# EAGLE design ATMegaBoardReduced (EAGLE 9.5.0)
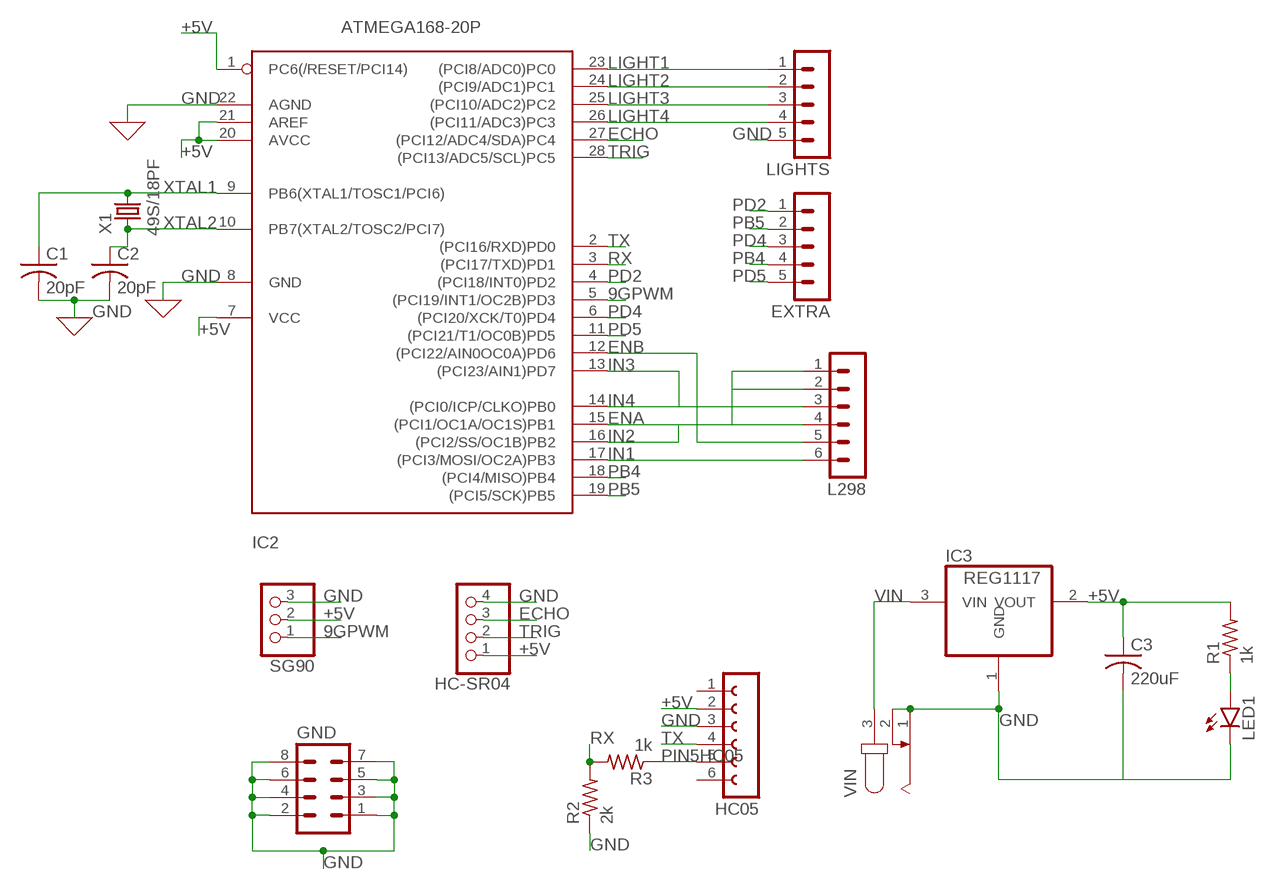
[diagram p0: schematic, sheet 1]

## Parts
C1  20pF  C-US050-024X044  [C050-024X044]
C2  20pF  C-US050-024X044  [C050-024X044]
C3  220uF  C-US050-024X044  [C050-024X044]
EXTRA  MA05-1  [MA05-1]
GND  MA04-2  [MA04-2]
HC05  FE06W  [FE06W]
HC-SR04  PINHD-1X4  [1X04]
IC2  ATMEGA168-20P  [DIL28-3]
IC3  REG1117  [SOT223]
L298  MA06-1  [MA06-1]
LED1  LED5MM  [LED5MM]
LIGHTS  MA05-1  [MA05-1]
R1  1k  R-US_0207/10  [0207/10]
R2  2k  R-US_0207/10  [0207/10]
R3  1k  R-US_0207/10  [0207/10]
SG90  PINHD-1X3  [1X03]
VIN  JACK-PLUG1  [SPC4078]
X1  49S/18PF  [XTAL_HC49]

## Nets
9GPWM: IC2.5((PCI19/INT1/OC2B)PD3) SG90.1
+5V [5v]: C3.1 HC05.2 HC-SR04.1 IC2.1(PC6(/RESET/PCI14)) IC2.7(VCC) IC2.20(AVCC) IC2.21(AREF) IC3.2(VOUT) R1.2 SG90.2
ECHO: HC-SR04.3 IC2.27((PCI12/ADC4/SDA)PC4)
ENA: IC2.15((PCI1/OC1A/OC1S)PB1) L298.2
ENB: IC2.12((PCI22/AIN0OC0A)PD6) L298.5
GND [Power]: C1.2 C2.2 C3.2 GND.1 GND.2 GND.3 GND.4 GND.5 GND.6 GND.7 GND.8 HC05.3 HC-SR04.4 IC2.8(GND) IC2.22(AGND) IC3.1(GND) LED1.K(C) LIGHTS.5 R2.1 SG90.3 VIN.1 VIN.2
IN1: IC2.17((PCI3/MOSI/OC2A)PB3) L298.6
IN2: IC2.16((PCI2/SS/OC1B)PB2) L298.4
IN3: IC2.13((PCI23/AIN1)PD7) L298.3
IN4: IC2.14((PCI0/ICP/CLKO)PB0) L298.1
LIGHT1: IC2.23((PCI8/ADC0)PC0) LIGHTS.1
LIGHT2: IC2.24((PCI9/ADC1)PC1) LIGHTS.2
LIGHT3: IC2.25((PCI10/ADC2)PC2) LIGHTS.3
LIGHT4: IC2.26((PCI11/ADC3)PC3) LIGHTS.4
N$3: LED1.A R1.1
PB4: EXTRA.4 IC2.18((PCI4/MISO)PB4)
PB5: EXTRA.2 IC2.19((PCI5/SCK)PB5)
PD2: EXTRA.1 IC2.4((PCI18/INT0)PD2)
PD4: EXTRA.3 IC2.6((PCI20/XCK/T0)PD4)
PD5: EXTRA.5 IC2.11((PCI21/T1/OC0B)PD5)
PIN5HC05: HC05.5 R3.1
RX: IC2.3((PCI17/TXD)PD1) R2.2 R3.2
TRIG: HC-SR04.2 IC2.28((PCI13/ADC5/SCL)PC5)
TX: HC05.4 IC2.2((PCI16/RXD)PD0)
VIN [Power]: IC3.3(VIN) VIN.3
XTAL1: C1.1 IC2.9(PB6(XTAL1/TOSC1/PCI6)) X1.2
XTAL2: C2.1 IC2.10(PB7(XTAL2/TOSC2/PCI7)) X1.1
Unconnected: HC05.1 HC05.6

## Library data of the parts
C1-C3 = rcl:C-US: CAPACITOR, American symbol; SPICEPREFIX: C
EXTRA LIGHTS = con-lstb:MA05-1: PIN HEADER; OC_FARNELL: unknown; OC_NEWARK: unknown
GND = con-lstb:MA04-2: PIN HEADER; OC_FARNELL: unknown; OC_NEWARK: unknown
HC05 = con-lsta:FE06W: FEMALE HEADER; OC_FARNELL: unknown; OC_NEWARK: unknown
HC-SR04 = pinhead:PINHD-1X4: PIN HEADER
IC2 = adafruit:ATMEGA168*P: MICROCONTROLLER 16 kBytes FLASH 1 kBytes SRAM 512 Bytes EEPROM USART 8-channel 10 bit ADC
IC3 = burr-brown:REG1117: 800mA and 1A Low Dropout (LDO) Positive Regulator 1.8V, 2.5V, 2.85V, 3.3V, 5V, and Adj; MPN: REG1117; OC_FARNELL: 1097566; OC_NEWARK: 14P6981
L298 = con-lstb:MA06-1: PIN HEADER; OC_FARNELL: unknown; OC_NEWARK: unknown
LED1 = led:LED: LED OSRAM: - CHIPLED LG R971, LG N971, LY N971, LG Q971, LY Q971, LO R971, LY R971 LH N974, LH R974 LS Q976, LO Q976, LY Q976 LO Q996 - Hyper CHIPLED LW Q18S LB Q993, LB Q99A, LB R99A - SideLED LS A670, LO A670, LY A670, LG A670, LP A670 LB A673, LV A673, LT A673, LW A673 LH A674 LY A675 LS A676, LA A676, LO A676, LY A676, LW A676 LS A679, LY A679, LG A679 - Hyper Micro SIDELED® LS Y876, LA Y876, LO Y876, LY Y876 LT Y87S - SmartLED LW L88C, LW L88S LB L89C, LB L89S, LG L890 LS L89K, LO L89K, LY L89K LS L896, LA L896, LO L896, LY L896 - TOPLED LS T670, LO T670, LY T670, LG T670, LP T670 LSG T670, LSP T670, LSY T670, LOP T670, LYG T670 LG T671, LOG T671, LSG T671 LB T673, LV T673, LT T673, LW T673 LH T674 LS T676, LA T676, LO T676, LY T676, LB T676, LH T676, LSB T676, LW T676 LB T67C, LV T67C, LT T67C, LS T67K, LO T67K, LY T67K, LW E67C LS E67B, LA E67B, LO E67B, LY E67B, LB E67C, LV E67C, LT E67C LW T67C LS T679, LY T679, LG T679 LS T770, LO T770, LY T770, LG T770, LP T770 LB T773, LV T773, LT T773, LW T773 LH T774 LS E675, LA E675, LY E675, LS T675 LS T776, LA T776, LO T776, LY T776, LB T776 LHGB T686 LT T68C, LB T68C - Hyper Mini TOPLED® LB M676 - Mini TOPLED Santana® LG M470 LS M47K, LO M47K, LY M47K Source: http://www.osram.convergy.de LUXEON: - LUMILED® LXK2-PW12-R00, LXK2-PW12-S00, LXK2-PW14-U00, LXK2-PW14-V00 LXK2-PM12-R00, LXK2-PM12-S00, LXK2-PM14-U00 LXK2-PE12-Q00, LXK2-PE12-R00, LXK2-PE12-S00, LXK2-PE14-T00, LXK2-PE14-U00 LXK2-PB12-K00, LXK2-PB12-L00, LXK2-PB12-M00, LXK2-PB14-N00, LXK2-PB14-P00, LXK2-PB14-Q00 LXK2-PR12-L00, LXK2-PR12-M00, LXK2-PR14-Q00, LXK2-PR14-R00 LXK2-PD12-Q00, LXK2-PD12-R00, LXK2-PD12-S00 LXK2-PH12-R00, LXK2-PH12-S00 LXK2-PL12-P00, LXK2-PL12-Q00, LXK2-PL12-R00 Source: www.luxeon.com KINGBRIGHT: KA-3528ASYC Source: www.kingbright.com
R1-R3 = rcl:R-US_: RESISTOR, American symbol; SPICEPREFIX: R
SG90 = pinhead:PINHD-1X3: PIN HEADER
VIN = con-jack:JACK-PLUG: DC POWER JACK Power Jack, DC, Right Angle, Through Hole, Rated 5A at 16VDC, PC Terminals Distributor: Farnell (www.Farnell.de) Drawing: 84N1161.pdf / 84N1162.pdf Manufacturer: SPC Technology (www.spctechnology.com) Type: SPC4077 / SPC 4078; OC_FARNELL: unknown; OC_NEWARK: unknown
X1 = Crystals:49S/18PF: Crystal Manufacturer's datasheet <https://datasheet.octopart.com/49S-18PF-Xinhunjing-datasheet-30677139.pdf>; CREATED_BY: PCBLayout.com; MANUFACTURER: Xinhunjing; MPN: 49S/18PF; PACKAGE: SMD

## Net classes
1 Power: width 1.778 mm
2 5v: width 0.762 mm

## Board
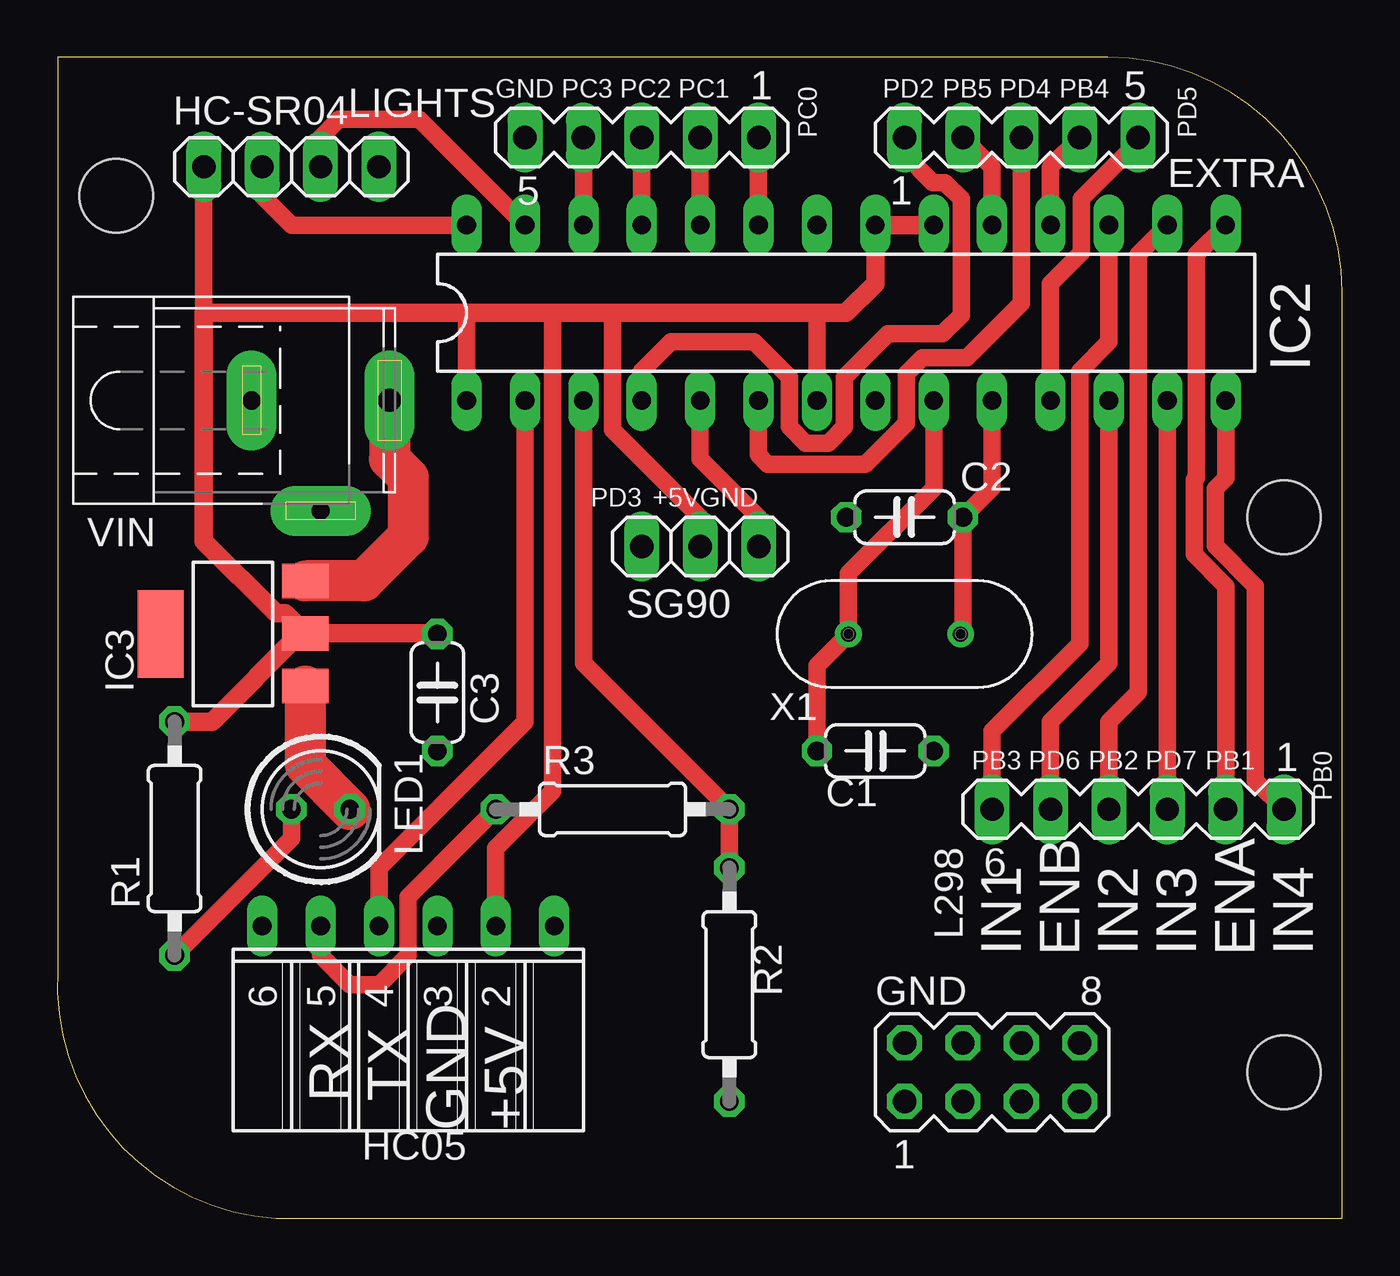
[diagram p1: board, top side]
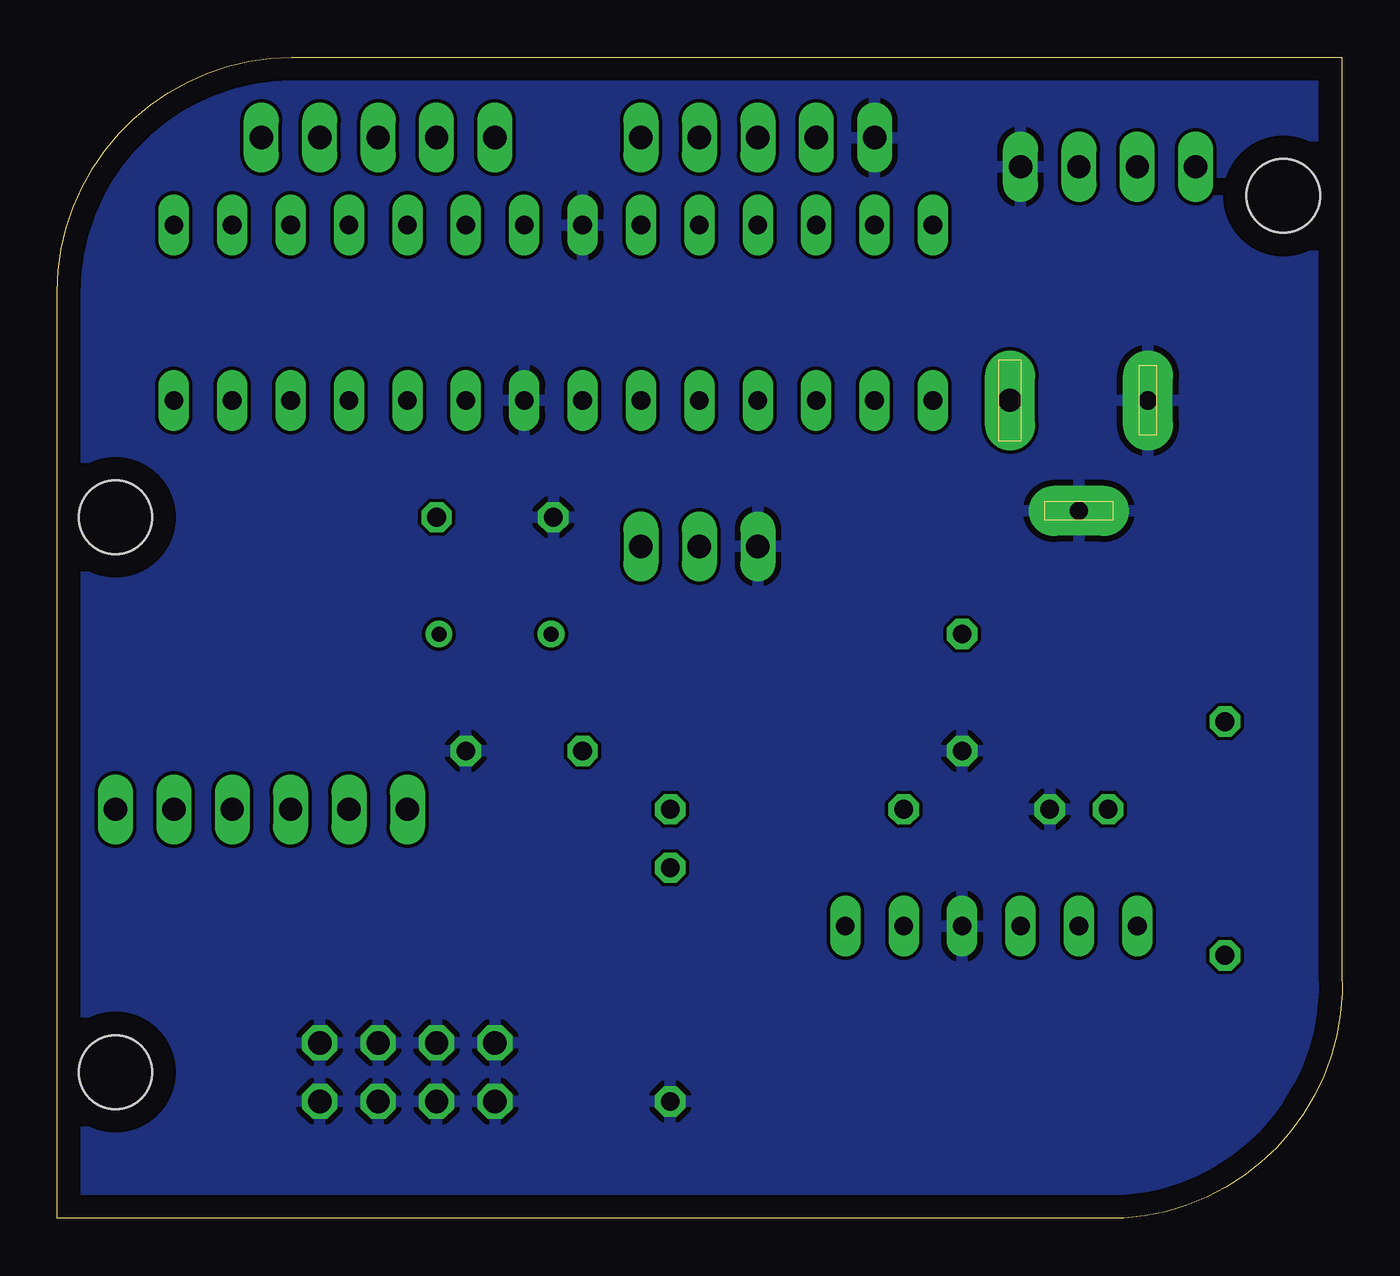
[diagram p2: board, bottom side, seen from below]

Size 55.88 x 50.47 mm. Coordinates in mm from the lower left corner, seen from the top.
Outline: 45.69,50.47 0.02,50.47 0.02,10.75 arc90 9.49,0 55.88,0 55.88,40.28 arc90 45.69,50.47
Copper layers (1*16): Top 0.035mm / dielectric 1.5mm / Bottom 0.035mm
Design rules "default *": minimum track width 30mil, minimum drill 0.35mm, track to track 6mil, track to pad 6mil, pad to pad 6mil, via to via 6mil, smd to smd 6mil, copper to edge 40mil, drill to drill 6mil, minimum pad ring 10mil, minimum via ring 8mil, stop-mask expansion 4mil, vias tented up to drill 0mil, thermal gap 10mil
Holes 3.2 mm at 2.56,44.45 53.36,30.48 53.36,6.35

### Footprints (pad centres in the part's own frame; a part is rotated, then mirrored left to right if it is on the bottom)
C050-024X044 = drill 0.813 octagon: 1 -2.54,0; 2 2.54,0
MA05-1 = drill 1.016 long: 1 -5.08,0; 2 -2.54,0; 3 0,0; 4 2.54,0; 5 5.08,0
MA04-2 = drill 1.016 octagon: 1 -3.81,-1.27; 2 -3.81,1.27; 3 -1.27,-1.27; 4 -1.27,1.27; 5 1.27,-1.27; 6 1.27,1.27; 7 3.81,-1.27; 8 3.81,1.27
FE06W = drill 0.813 long: 1 -6.35,0; 2 -3.81,0; 3 -1.27,0; 4 1.27,0; 5 3.81,0; 6 6.35,0
1X04 = drill 1.016 long: 1 -3.81,0; 2 -1.27,0; 3 1.27,0; 4 3.81,0
DIL28-3 = drill 0.813 long: 1 -16.51,-3.81; 2 -13.97,-3.81; 3 -11.43,-3.81; 4 -8.89,-3.81; 5 -6.35,-3.81; 6 -3.81,-3.81; 7 -1.27,-3.81; 8 1.27,-3.81; 9 3.81,-3.81; 10 6.35,-3.81; 11 8.89,-3.81; 12 11.43,-3.81; 13 13.97,-3.81; 14 16.51,-3.81; 15 16.51,3.81; 16 13.97,3.81; 17 11.43,3.81; 18 8.89,3.81; 19 6.35,3.81; 20 3.81,3.81; 21 1.27,3.81; 22 -1.27,3.81; 23 -3.81,3.81; 24 -6.35,3.81; 25 -8.89,3.81; 26 -11.43,3.81; 27 -13.97,3.81; 28 -16.51,3.81
SOT223 = smd 1.499 x 2.007: 1 -2.261,-3.15; 2 0.025,-3.15; 3 2.311,-3.15 | smd 3.81 x 2.007: 4 0,3.15
MA06-1 = drill 1.016 long: 1 -6.35,0; 2 -3.81,0; 3 -1.27,0; 4 1.27,0; 5 3.81,0; 6 6.35,0
LED5MM = drill 0.813 octagon: A -1.27,0; K 1.27,0
0207/10 = drill 0.813 octagon: 1 -5.08,0; 2 5.08,0
1X03 = drill 1.016 long: 1 -2.54,0; 2 0,0; 3 2.54,0
SPC4078 = drill 0.8 pad 2.184 long: 1 -3,0; 2 0,-4.8 | drill 1 pad 2.184 long: 3 3,0
XTAL_HC49 = drill 0.65 pad 1.05: 1 -2.44,0; 2 2.44,0

### Placement (x,y rotation side)
C1  35.58,20.32 0 top
C2  36.85,30.48 180 top
C3  16.53,22.86 270 top
EXTRA  41.93,46.99 0 top
GND  40.66,6.35 0 top
HC05  15.26,12.7 180 top
HC-SR04  10.18,45.72 0 top
IC2  34.31,39.37 0 top
IC3  7.64,25.4 90 top
L298  47.01,17.78 180 top
LED1  11.45,17.78 0 top
LIGHTS  25.42,46.99 180 top
R1  5.1,16.51 90 top
R2  29.23,10.16 90 top
R3  24.15,17.78 0 top
SG90  27.96,29.21 180 top
VIN  11.45,35.56 0 top
X1  36.85,25.4 180 top

### Tracks (layer width: path | path; a pad name or v marks a point on that pad's centre or on a via)
9GPWM
  Top 0.762: SG90.1 30.5,30.48 27.96,33.02 IC2.5
+5V
  Top 0.762: IC2.7 33.04,39.37 | 24.15,39.37 24.15,34.29 27.96,30.48 SG90.2 | HC-SR04.1 6.37,39.37 | HC05.2 19.07,16.09 21.53,18.56 21.53,39.29 | 16.5,25.42 C3.1 | 10.56,25.42 IC3.2 | 21.53,39.29 21.45,39.37 | 21.53,39.29 21.61,39.37 | IC2.1 17.8,39.37
  Top 0.813: 10.56,25.42 6.73,21.59 R1.2 | 21.45,39.37 17.8,39.37 6.37,39.37 6.37,29.44 9.51,26.3 9.91,26.3 IC3.2 16.5,25.42 | IC2.20 IC2.21 35.58,40.64 34.31,39.37 33.04,39.37 24.15,39.37 21.61,39.37
ECHO
  Top 0.762: HC-SR04.3 11.45,46.99 12.23,47.78 15.74,47.78 IC2.27
ENA
  Top 0.762: IC2.15 49.55,41.91 49.55,32.2 49.44,32.1 49.44,28.86 50.82,27.49 L298.2
ENB
  Top 0.762: L298.5 43.2,21.59 45.74,24.13 IC2.12
GND
  Top 1.778: LED1.K 10.79,19.71 IC3.1
  pour Bottom: 0.02,0 0.02,50.8 55.9,50.8 55.9,0
IN1
  Top 0.762: IC2.17 45.74,38.1 44.47,36.83 44.47,24.98 40.66,21.17 L298.6
IN2
  Top 0.762: L298.4 45.74,21.59 47.01,22.86 47.01,41.91 IC2.16
IN3
  Top 0.762: IC2.13 L298.3
IN4
  Top 0.762: L298.1 52.11,19.02 52.11,27.49 50.36,29.24 50.36,31.72 50.82,32.18 IC2.14
LIGHT1
  Top 0.762: LIGHTS.1 IC2.23
LIGHT2
  Top 0.762: LIGHTS.2 IC2.24
LIGHT3
  Top 0.762: LIGHTS.3 IC2.25
LIGHT4
  Top 0.762: LIGHTS.4 IC2.26
N$3
  Top 0.762: LED1.A 10.18,16.51 R1.1
PB4
  Top 0.762: IC2.18 43.2,45.67 43.22,45.69 43.22,45.75 EXTRA.4
PB5
  Top 0.762: IC2.19 40.66,45.72 EXTRA.2
PD2
  Top 0.762: EXTRA.1 36.85,46.28 38.09,45.03 38.61,45.03 39.31,44.34 39.31,39.27 38.49,38.46 36.12,38.46 34.23,36.56 34.23,34.41 33.53,33.71 32.54,33.71 31.84,34.41 31.84,36.56 30.3,38.1 26.69,38.1 25.42,36.83 IC2.4
PD4
  Top 0.762: IC2.6 30.5,33.19 30.89,32.79 35.16,32.79 36.92,34.56 36.92,36.72 37.62,37.41 39.56,37.41 41.93,39.78 41.93,45.67 41.95,45.69 41.95,46.97 EXTRA.3
PD5
  Top 0.762: IC2.11 43.2,40.64 44.54,41.99 44.54,44.34 47.01,46.8 EXTRA.5
PIN5HC05
  Top 0.762: R3.1 15.26,13.97 15.26,11.43 13.99,10.16 12.72,10.16 11.45,11.43 HC05.5
RX
  Top 0.762: R2.2 R3.2 22.88,24.13 IC2.3
TRIG
  Top 0.762: HC-SR04.2 8.91,44.45 10.18,43.18 IC2.28
TX
  Top 0.762: IC2.2 20.34,21.59 13.99,15.24 HC05.4
VIN
  Top 1.778: IC3.3 13.33,27.71 15.26,29.64 15.26,32.21 14.45,33.02 VIN.3
XTAL1
  Top 0.762: C1.1 33.04,24.03 X1.2 34.41,28.04 38.12,31.75 IC2.9
XTAL2
  Top 0.762: X1.1 39.39,25.5 C2.1 40.66,31.75 IC2.10

### Text on the board
tPlace: GND | PC3 | PC2 | PC1 | PD2 | PB5 | PD4 | PB4 | PC0 | PD5 | PD3 | +5V | GND | PB3 | PD6 | PB2 | PD7 | PB1 | PB0 | IN1 | ENB | IN2 | IN3 | ENA | IN4 | RX | TX | GND | +5V